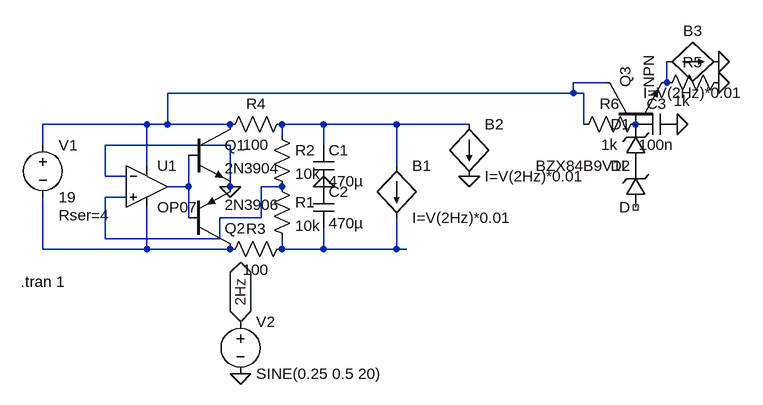
[diagram p0: schematic RailSplitter.asc]
RailSplitter.asc, the LTspice schematic file:
Version 4
SHEET 1 1124 680
WIRE 896 80 848 80
WIRE 992 80 992 48
WIRE 848 96 848 80
WIRE 848 96 224 96
WIRE 864 96 848 96
WIRE 192 144 32 144
WIRE 224 144 224 96
WIRE 224 144 192 144
WIRE 320 144 224 144
WIRE 464 144 400 144
WIRE 576 144 464 144
WIRE 688 144 576 144
WIRE 864 144 864 96
WIRE 400 160 400 144
WIRE 32 176 32 144
WIRE 320 176 128 176
WIRE 464 176 464 144
WIRE 192 208 192 144
WIRE 576 208 576 144
WIRE 128 224 128 176
WIRE 160 224 128 224
WIRE 256 240 256 192
WIRE 256 240 224 240
WIRE 320 240 320 176
WIRE 400 240 368 240
WIRE 160 256 128 256
WIRE 256 288 256 240
WIRE 368 288 368 240
WIRE 368 288 304 288
WIRE 128 320 128 256
WIRE 304 320 304 288
WIRE 304 320 128 320
WIRE 32 336 32 256
WIRE 192 336 192 272
WIRE 192 336 32 336
WIRE 320 336 192 336
WIRE 400 336 400 320
WIRE 464 336 464 304
WIRE 464 336 400 336
WIRE 576 336 576 288
WIRE 576 336 464 336
WIRE 592 336 576 336
FLAG 320 240 0
FLAG 336 528 0
FLAG 336 448 2Hz
IOPIN 336 448 BiDir
FLAG 464 240 0
FLAG 688 224 0
FLAG 1072 80 0
FLAG 1008 144 0
FLAG 1072 48 0
SYMBOL voltage 32 160 R0
WINDOW 123 0 0 Left 0
WINDOW 39 24 124 Left 2
SYMATTR InstName V1
SYMATTR Value 19
SYMATTR SpiceLine Rser=4
SYMBOL res 416 320 R90
WINDOW 0 0 56 VBottom 2
WINDOW 3 32 56 VTop 2
SYMATTR InstName R3
SYMATTR Value 100
SYMBOL res 416 128 R90
WINDOW 0 0 56 VBottom 2
WINDOW 3 32 56 VTop 2
SYMATTR InstName R4
SYMATTR Value 100
SYMBOL Opamps\\OP07 192 176 R0
SYMATTR InstName U1
SYMBOL npn 256 144 R0
SYMATTR InstName Q1
SYMATTR Value 2N3904
SYMBOL pnp 256 336 M180
SYMATTR InstName Q2
SYMATTR Value 2N3906
SYMBOL res 384 224 R0
SYMATTR InstName R1
SYMATTR Value 10k
SYMBOL res 384 144 R0
SYMATTR InstName R2
SYMATTR Value 10k
SYMBOL bi 576 208 R0
SYMATTR InstName B1
SYMATTR Value I=V(2Hz)*0.01
SYMBOL voltage 336 432 R0
WINDOW 123 0 0 Left 0
WINDOW 39 0 0 Left 0
SYMATTR InstName V2
SYMATTR Value SINE(0.25 0.5 20)
SYMBOL cap 448 176 R0
SYMATTR InstName C1
SYMATTR Value 470µ
SYMBOL cap 448 240 R0
SYMATTR InstName C2
SYMATTR Value 470µ
SYMBOL bi 688 144 R0
SYMATTR InstName B2
SYMATTR Value I=V(2Hz)*0.01
SYMBOL zener 960 208 R180
WINDOW 0 24 64 Left 2
WINDOW 3 24 0 Left 2
SYMATTR InstName D1
SYMATTR Value BZX84B9V1L
SYMBOL zener 960 272 R180
WINDOW 0 24 64 Left 2
WINDOW 3 24 0 Left 2
SYMATTR InstName D2
SYMBOL res 1088 64 R90
WINDOW 0 0 56 VBottom 2
WINDOW 3 28 73 VTop 2
SYMATTR InstName R5
SYMATTR Value 1k
SYMBOL res 960 128 R90
WINDOW 0 0 56 VBottom 2
WINDOW 3 32 56 VTop 2
SYMATTR InstName R6
SYMATTR Value 1k
SYMBOL cap 1008 128 R90
WINDOW 0 0 32 VBottom 2
WINDOW 3 32 32 VTop 2
SYMATTR InstName C3
SYMATTR Value 100n
SYMBOL npn 896 144 R270
SYMATTR InstName Q3
SYMBOL bi 992 48 R270
WINDOW 0 32 40 VTop 2
WINDOW 3 -32 40 VBottom 2
SYMATTR InstName B3
SYMATTR Value I=V(2Hz)*0.01
TEXT -2 386 Left 2 !.tran 1

The netlist it stands for:
* RailSplitter.asc
V1 N001 N006 19 Rser=4
R3 N007 N006 100
R4 N003 N001 100
XU1 N005 0 N001 N006 N004 LT1001  ; OP07, pins In+ In- V+ V- OUT
Q1 N001 N004 0 0 2N3904
Q2 N006 N004 0 0 2N3906
R1 N005 N007 10k
R2 N003 N005 10k
B1 N003 N007 I=V(2Hz)*0.01
V2 2Hz 0 SINE(0.25 0.5 20)
C1 N003 0 470µ
C2 0 N007 470µ
B2 N003 0 I=V(2Hz)*0.01
D1 P001 P002 BZX84B9V1L
D2 NC_01 P001 D
R5 0 N002 1k
R6 P002 N001 1k
C3 0 P002 100n
Q3 N001 P002 N002 0 NPN
B3 N002 0 I=V(2Hz)*0.01
.model D D
.lib standard.dio
.model NPN NPN
.model PNP PNP
.lib standard.bjt
.tran 1
.lib LTC.lib
.backanno
.end